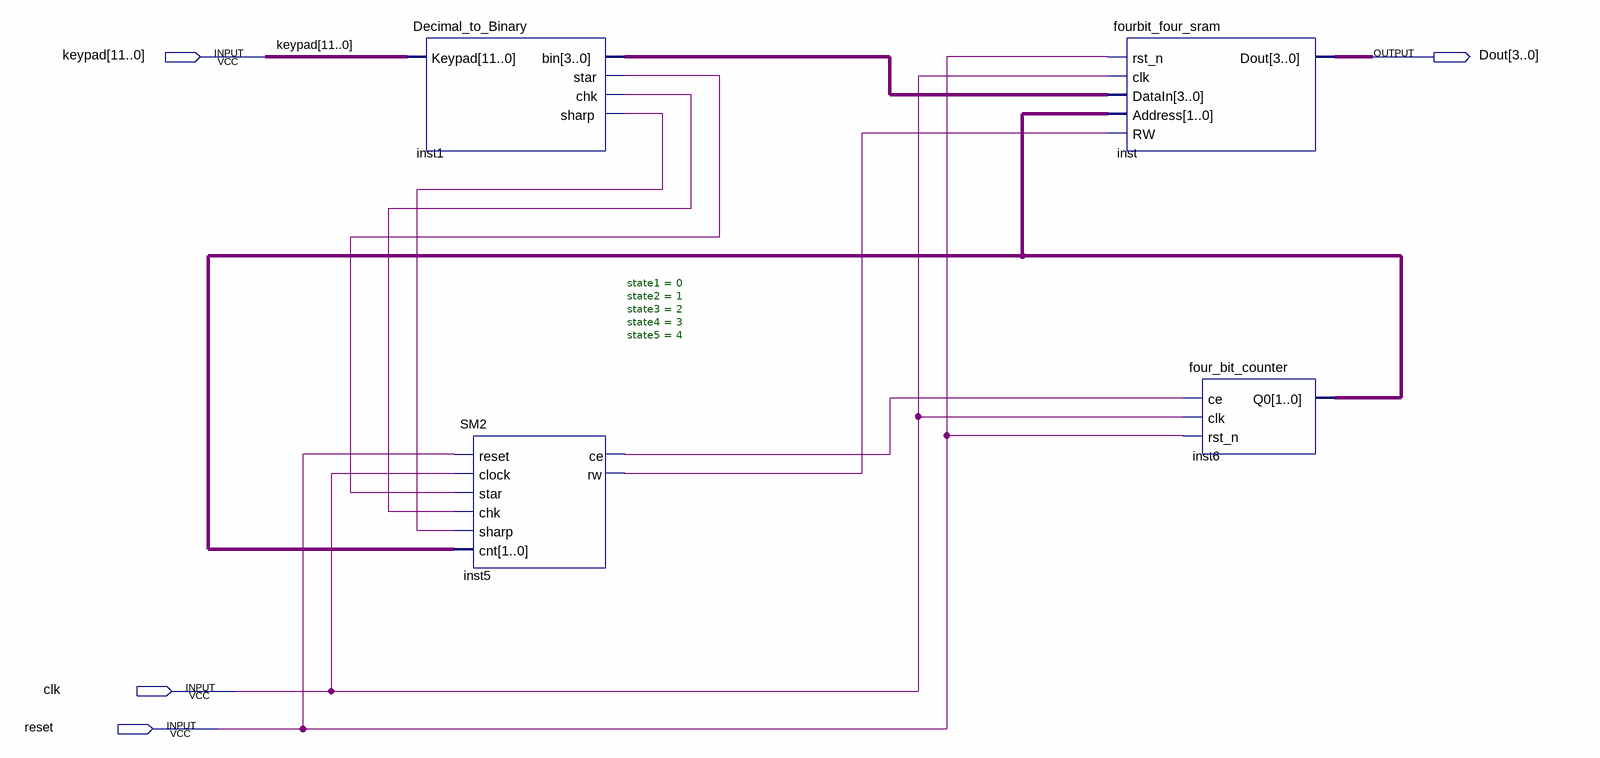
[diagram p0: schematic sheet]
// Quartus schematic week6_2.bdf as structural Verilog: 4 symbols, 4 pins
module week6_2 (
  input  [11:0] keypad,
  input  clk,
  input  reset,
  output [3:0] Dout
);

  wire inst1_chk, inst1_sharp, inst1_star, inst5_ce, inst5_rw;
  wire [1:0] inst6_q0;
  wire [3:0] inst1_bin;

  Decimal_to_Binary inst1 (.Keypad(keypad), .bin(inst1_bin), .star(inst1_star), .chk(inst1_chk), .sharp(inst1_sharp));
  SM2 #(.state1(0), .state2(1), .state3(2), .state4(3), .state5(4)) inst5 (
    .reset(reset), .clock(clk), .star(inst1_star), .chk(inst1_chk), .sharp(inst1_sharp), .cnt(inst6_q0),
    .ce(inst5_ce), .rw(inst5_rw));
  fourbit_four_sram inst (.rst_n(reset), .clk(clk), .DataIn(inst1_bin), .Address(inst6_q0), .RW(inst5_rw), .Dout(Dout));
  four_bit_counter inst6 (.ce(inst5_ce), .clk(clk), .rst_n(reset), .Q0(inst6_q0));
endmodule
